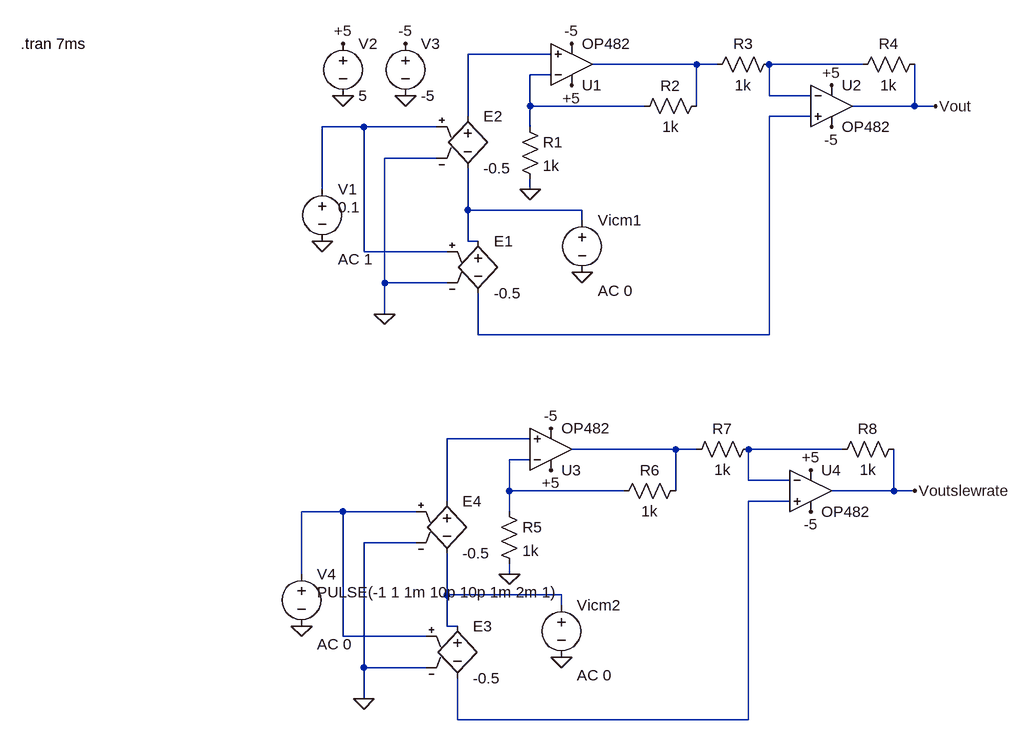
[diagram p0: schematic Etaj1SlewRate.asc]
Etaj1SlewRate.asc, the LTspice schematic file:
Version 4.1
SHEET 1 1084 680
WIRE 352 -720 224 -720
WIRE 576 -704 416 -704
WIRE 608 -704 576 -704
WIRE 832 -704 688 -704
WIRE 352 -688 320 -688
WIRE 688 -656 688 -704
WIRE 752 -656 688 -656
WIRE 320 -640 320 -688
WIRE 496 -640 320 -640
WIRE 576 -640 576 -704
WIRE 912 -640 912 -704
WIRE 912 -640 816 -640
WIRE 944 -640 912 -640
WIRE 224 -624 224 -720
WIRE 752 -624 688 -624
WIRE 64 -608 0 -608
WIRE 176 -608 64 -608
WIRE 320 -608 320 -640
WIRE 176 -560 96 -560
WIRE 0 -512 0 -608
WIRE 320 -512 320 -528
WIRE 224 -480 224 -544
WIRE 400 -480 224 -480
WIRE 400 -464 400 -480
WIRE 224 -432 224 -480
WIRE 240 -432 224 -432
WIRE 64 -416 64 -608
WIRE 192 -416 64 -416
WIRE 96 -368 96 -560
WIRE 192 -368 96 -368
WIRE 96 -320 96 -368
WIRE 240 -288 240 -352
WIRE 688 -288 688 -624
WIRE 688 -288 240 -288
WIRE 320 -128 192 -128
WIRE 544 -112 384 -112
WIRE 576 -112 544 -112
WIRE 800 -112 656 -112
WIRE 320 -96 288 -96
WIRE 656 -64 656 -112
WIRE 720 -64 656 -64
WIRE 288 -48 288 -96
WIRE 464 -48 288 -48
WIRE 544 -48 544 -112
WIRE 880 -48 880 -112
WIRE 880 -48 784 -48
WIRE 912 -48 880 -48
WIRE 192 -32 192 -128
WIRE 720 -32 656 -32
WIRE 32 -16 -32 -16
WIRE 144 -16 32 -16
WIRE 288 -16 288 -48
WIRE 144 32 64 32
WIRE -32 80 -32 -16
WIRE 288 80 288 64
WIRE 192 112 192 48
WIRE 368 112 192 112
WIRE 368 128 368 112
WIRE 192 160 192 112
WIRE 208 160 192 160
WIRE 32 176 32 -16
WIRE 160 176 32 176
WIRE 64 224 64 32
WIRE 160 224 64 224
WIRE 64 272 64 224
WIRE 208 304 208 240
WIRE 656 304 656 -32
WIRE 656 304 208 304
FLAG 320 -512 0
FLAG 384 -672 +5
FLAG 384 -736 -5
FLAG 784 -608 -5
FLAG 784 -672 +5
FLAG 96 -320 0
FLAG 0 -432 0
FLAG 400 -384 0
FLAG 32 -736 +5
FLAG 128 -736 -5
FLAG 32 -656 0
FLAG 128 -656 0
FLAG 288 80 0
FLAG 912 -48 Voutslewrate
FLAG 352 -80 +5
FLAG 352 -144 -5
FLAG 752 -16 -5
FLAG 752 -80 +5
FLAG 64 272 0
FLAG -32 160 0
FLAG 368 208 0
FLAG 944 -640 Vout
DATAFLAG 720 -704 ""
DATAFLAG 224 -672 ""
DATAFLAG 272 -288 ""
DATAFLAG 912 -672 ""
SYMBOL OpAmps\\OP482 384 -640 M180
SYMATTR InstName U1
SYMBOL OpAmps\\OP482 784 -704 R0
SYMATTR InstName U2
SYMBOL res 304 -624 R0
SYMATTR InstName R1
SYMATTR Value 1k
SYMBOL res 592 -656 R90
WINDOW 0 0 56 VBottom 2
WINDOW 3 32 56 VTop 2
SYMATTR InstName R2
SYMATTR Value 1k
SYMBOL res 704 -720 R90
WINDOW 0 0 56 VBottom 2
WINDOW 3 32 56 VTop 2
SYMATTR InstName R3
SYMATTR Value 1k
SYMBOL res 928 -720 R90
WINDOW 0 0 56 VBottom 2
WINDOW 3 32 56 VTop 2
SYMATTR InstName R4
SYMATTR Value 1k
SYMBOL e 240 -448 R0
SYMATTR InstName E1
SYMATTR Value -0.5
SYMBOL e 224 -640 R0
SYMATTR InstName E2
SYMATTR Value -0.5
SYMBOL voltage 0 -528 R0
WINDOW 123 24 124 Left 2
WINDOW 39 0 0 Left 0
WINDOW 3 24 44 Left 2
SYMATTR Value2 AC 1
SYMATTR Value 0.1
SYMATTR InstName V1
SYMBOL voltage 400 -480 R0
WINDOW 123 24 124 Left 2
WINDOW 39 0 0 Left 0
SYMATTR Value2 AC 0
SYMATTR InstName Vicm1
SYMATTR Value ""
SYMBOL voltage 32 -752 R0
SYMATTR InstName V2
SYMATTR Value 5
SYMBOL voltage 128 -752 R0
SYMATTR InstName V3
SYMATTR Value -5
SYMBOL OpAmps\\OP482 352 -48 M180
SYMATTR InstName U3
SYMBOL OpAmps\\OP482 752 -112 R0
SYMATTR InstName U4
SYMBOL res 272 -32 R0
SYMATTR InstName R5
SYMATTR Value 1k
SYMBOL res 560 -64 R90
WINDOW 0 0 56 VBottom 2
WINDOW 3 32 56 VTop 2
SYMATTR InstName R6
SYMATTR Value 1k
SYMBOL res 672 -128 R90
WINDOW 0 0 56 VBottom 2
WINDOW 3 32 56 VTop 2
SYMATTR InstName R7
SYMATTR Value 1k
SYMBOL res 896 -128 R90
WINDOW 0 0 56 VBottom 2
WINDOW 3 32 56 VTop 2
SYMATTR InstName R8
SYMATTR Value 1k
SYMBOL e 208 144 R0
SYMATTR InstName E3
SYMATTR Value -0.5
SYMBOL e 192 -48 R0
SYMATTR InstName E4
SYMATTR Value -0.5
SYMBOL voltage -32 64 R0
WINDOW 123 24 124 Left 2
WINDOW 39 0 0 Left 0
WINDOW 3 24 44 Left 2
SYMATTR Value2 AC 0
SYMATTR Value PULSE(-1 1 1m 10p 10p 1m 2m 1)
SYMATTR InstName V4
SYMBOL voltage 368 112 R0
WINDOW 123 24 124 Left 2
WINDOW 39 0 0 Left 0
SYMATTR Value2 AC 0
SYMATTR InstName Vicm2
SYMATTR Value ""
TEXT -464 -736 Left 2 !.tran 7ms

The netlist it stands for:
* Etaj1SlewRate.asc
X§U1 N001 N004 +5 -5 N002 OP482  ; pins In+ In- V+ V- OUT
X§U2 N005 N003 +5 -5 Vout OP482  ; pins In+ In- V+ V- OUT
R1 N004 0 1k
R2 N002 N004 1k
R3 N003 N002 1k
R4 Vout N003 1k
E1 N007 N005 N006 0 -0.5
E2 N001 N007 N006 0 -0.5
V1 N006 0 0.1 AC 1
Vicm1 N007 0 AC 0
V2 +5 0 5
V3 -5 0 -5
X§U3 N008 N011 +5 -5 N009 OP482  ; pins In+ In- V+ V- OUT
X§U4 N012 N010 +5 -5 Voutslewrate OP482  ; pins In+ In- V+ V- OUT
R5 N011 0 1k
R6 N009 N011 1k
R7 N010 N009 1k
R8 Voutslewrate N010 1k
E3 N014 N012 N013 0 -0.5
E4 N008 N014 N013 0 -0.5
V4 N013 0 PULSE(-1 1 1m 10p 10p 1m 2m 1) AC 0
Vicm2 N014 0 AC 0
.tran 7ms
.backanno
.end